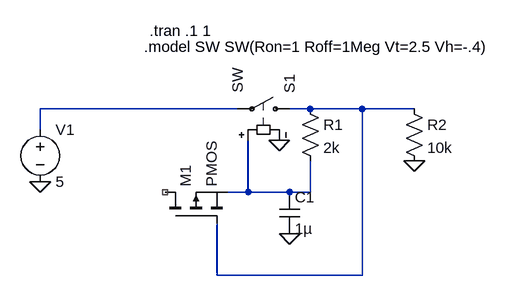
[diagram p0: schematic ship mode.asc]
ship mode.asc, the LTspice schematic file:
Version 4
SHEET 1 880 680
WIRE 416 256 112 256
WIRE 528 256 496 256
WIRE 608 256 528 256
WIRE 688 256 608 256
WIRE 112 288 112 256
WIRE 432 384 432 304
WIRE 432 384 400 384
WIRE 496 384 432 384
WIRE 528 384 528 336
WIRE 528 384 496 384
WIRE 384 512 384 432
WIRE 608 512 608 256
WIRE 608 512 384 512
FLAG 112 368 0
FLAG 480 304 0
FLAG 496 448 0
FLAG 688 336 0
SYMBOL sw 512 256 M270
SYMATTR InstName S1
SYMBOL pmos 304 432 R270
SYMATTR InstName M1
SYMBOL voltage 112 272 R0
SYMATTR InstName V1
SYMATTR Value 5
SYMBOL Res 512 240 R0
SYMATTR InstName R1
SYMATTR Value 2k
SYMBOL Cap 480 384 R0
SYMATTR InstName C1
SYMATTR Value 1µ
SYMBOL Res 672 240 R0
SYMATTR InstName R2
SYMATTR Value 10k
TEXT 272 160 Left 2 !.model SW SW(Ron=1 Roff=1Meg Vt=2.5 Vh=-.4)
TEXT 280 136 Left 2 !.tran .1 1

The netlist it stands for:
* ship mode.asc
S1 N002 N001 N003 0 SW
M1 NC_01 N002 N003 N003 PMOS
V1 N001 0 5
R1 N002 N003 2k
C1 N003 0 1µ
R2 N002 0 10k
.model NMOS NMOS
.model PMOS PMOS
.lib standard.mos
.model SW SW(Ron=1 Roff=1Meg Vt=2.5 Vh=-.4)
.tran .1 1
.backanno
.end